# EAGLE schematic voltage (EAGLE 8.5.2)
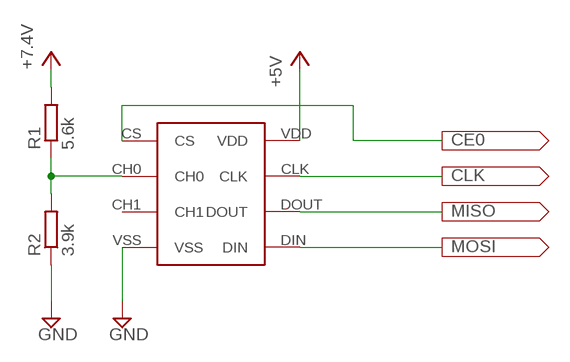
[diagram p0: schematic, sheet 1]

## Parts
R1  5.6k  R-EU_0204/7  [0204/7]
R2  3.9k  R-EU_0204/7  [0204/7]
U$1  MCP3002  [MCP3002]

## Nets
+5V: U$1.VDD
CE0: U$1.CS
GND: R2.1 U$1.VSS
N$1: R1.1 R2.2 U$1.CH0
N$2: U$1.CLK
N$3: U$1.DOUT
N$4: U$1.DIN
VCC: R1.2 ; supply symbol labelled +7.4V
Unconnected: U$1.CH1

## Library data of the parts
R1 R2 = resistor:R-EU_: RESISTOR, European symbol
U$1 = getter-sensor:MCP3002